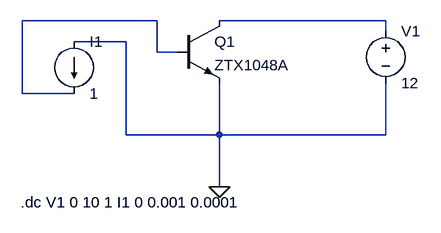
[diagram p0: schematic Draft1.asc]
Draft1.asc, the LTspice schematic file:
Version 4
SHEET 1 880 680
WIRE -80 80 -288 80
WIRE 272 80 16 80
WIRE 272 96 272 80
WIRE -128 112 -208 112
WIRE -80 128 -80 80
WIRE -48 128 -80 128
WIRE -288 192 -288 80
WIRE -208 192 -288 192
WIRE -128 256 -128 112
WIRE 16 256 16 176
WIRE 16 256 -128 256
WIRE 272 256 272 176
WIRE 272 256 16 256
WIRE 16 336 16 256
FLAG 16 336 0
SYMBOL voltage 272 80 R0
WINDOW 123 0 0 Left 0
WINDOW 39 0 0 Left 0
SYMATTR InstName V1
SYMATTR Value 12
SYMBOL current -208 112 R0
WINDOW 123 0 0 Left 0
WINDOW 39 0 0 Left 0
SYMATTR InstName I1
SYMATTR Value 1
SYMBOL npn -48 80 R0
SYMATTR InstName Q1
SYMATTR Value ZTX1048A
TEXT -290 360 Left 2 !.dc V1 0 10 1 I1 0 0.001 0.0001

The netlist it stands for:
* Draft1.asc
V1 N002 0 12
I1 0 N001 1
Q1 N002 N001 0 0 ZTX1048A
.model NPN NPN
.model PNP PNP
.lib standard.bjt
.dc V1 0 10 1 I1 0 0.001 0.0001
.backanno
.end